# EAGLE design PowerSupply_5V_v2 (EAGLE 9.6.2)

## Sheet 1 of 3: MAIN
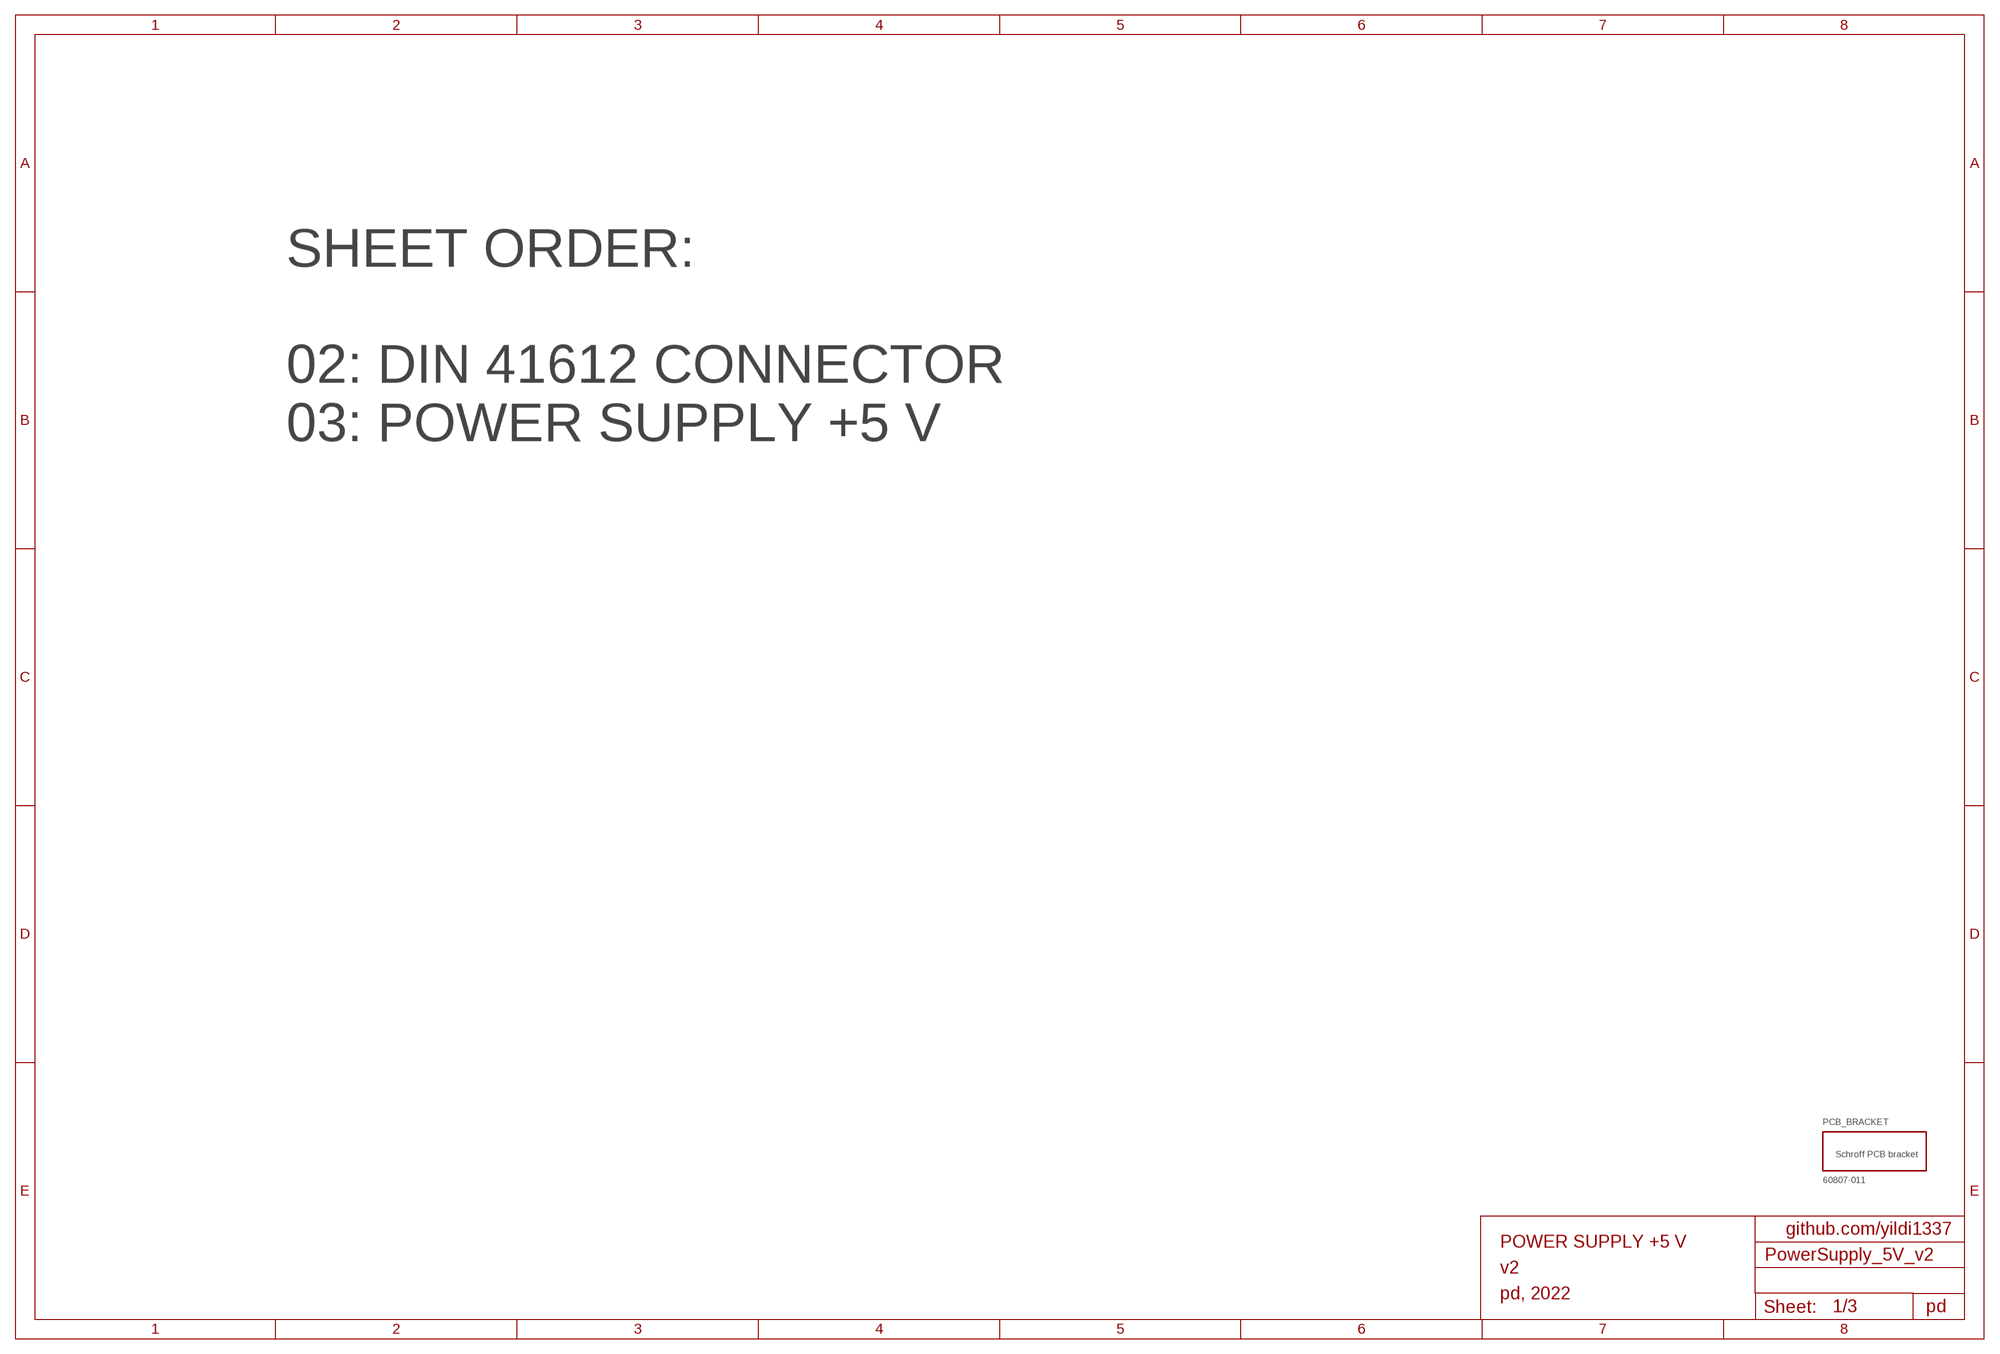
[diagram p0: schematic, sheet 1]

### Parts
PCB_BRACKET  60807-011  [60807-011]

### Notes on the sheet
- SHEET ORDER:
  
  02: DIN 41612 CONNECTOR
  03: POWER SUPPLY +5 V
- github.com/yildi1337
- POWER SUPPLY +5 V
- v2
- pd, 2022
- pd

## Sheet 2 of 3: DIN 41612 CONNECTOR
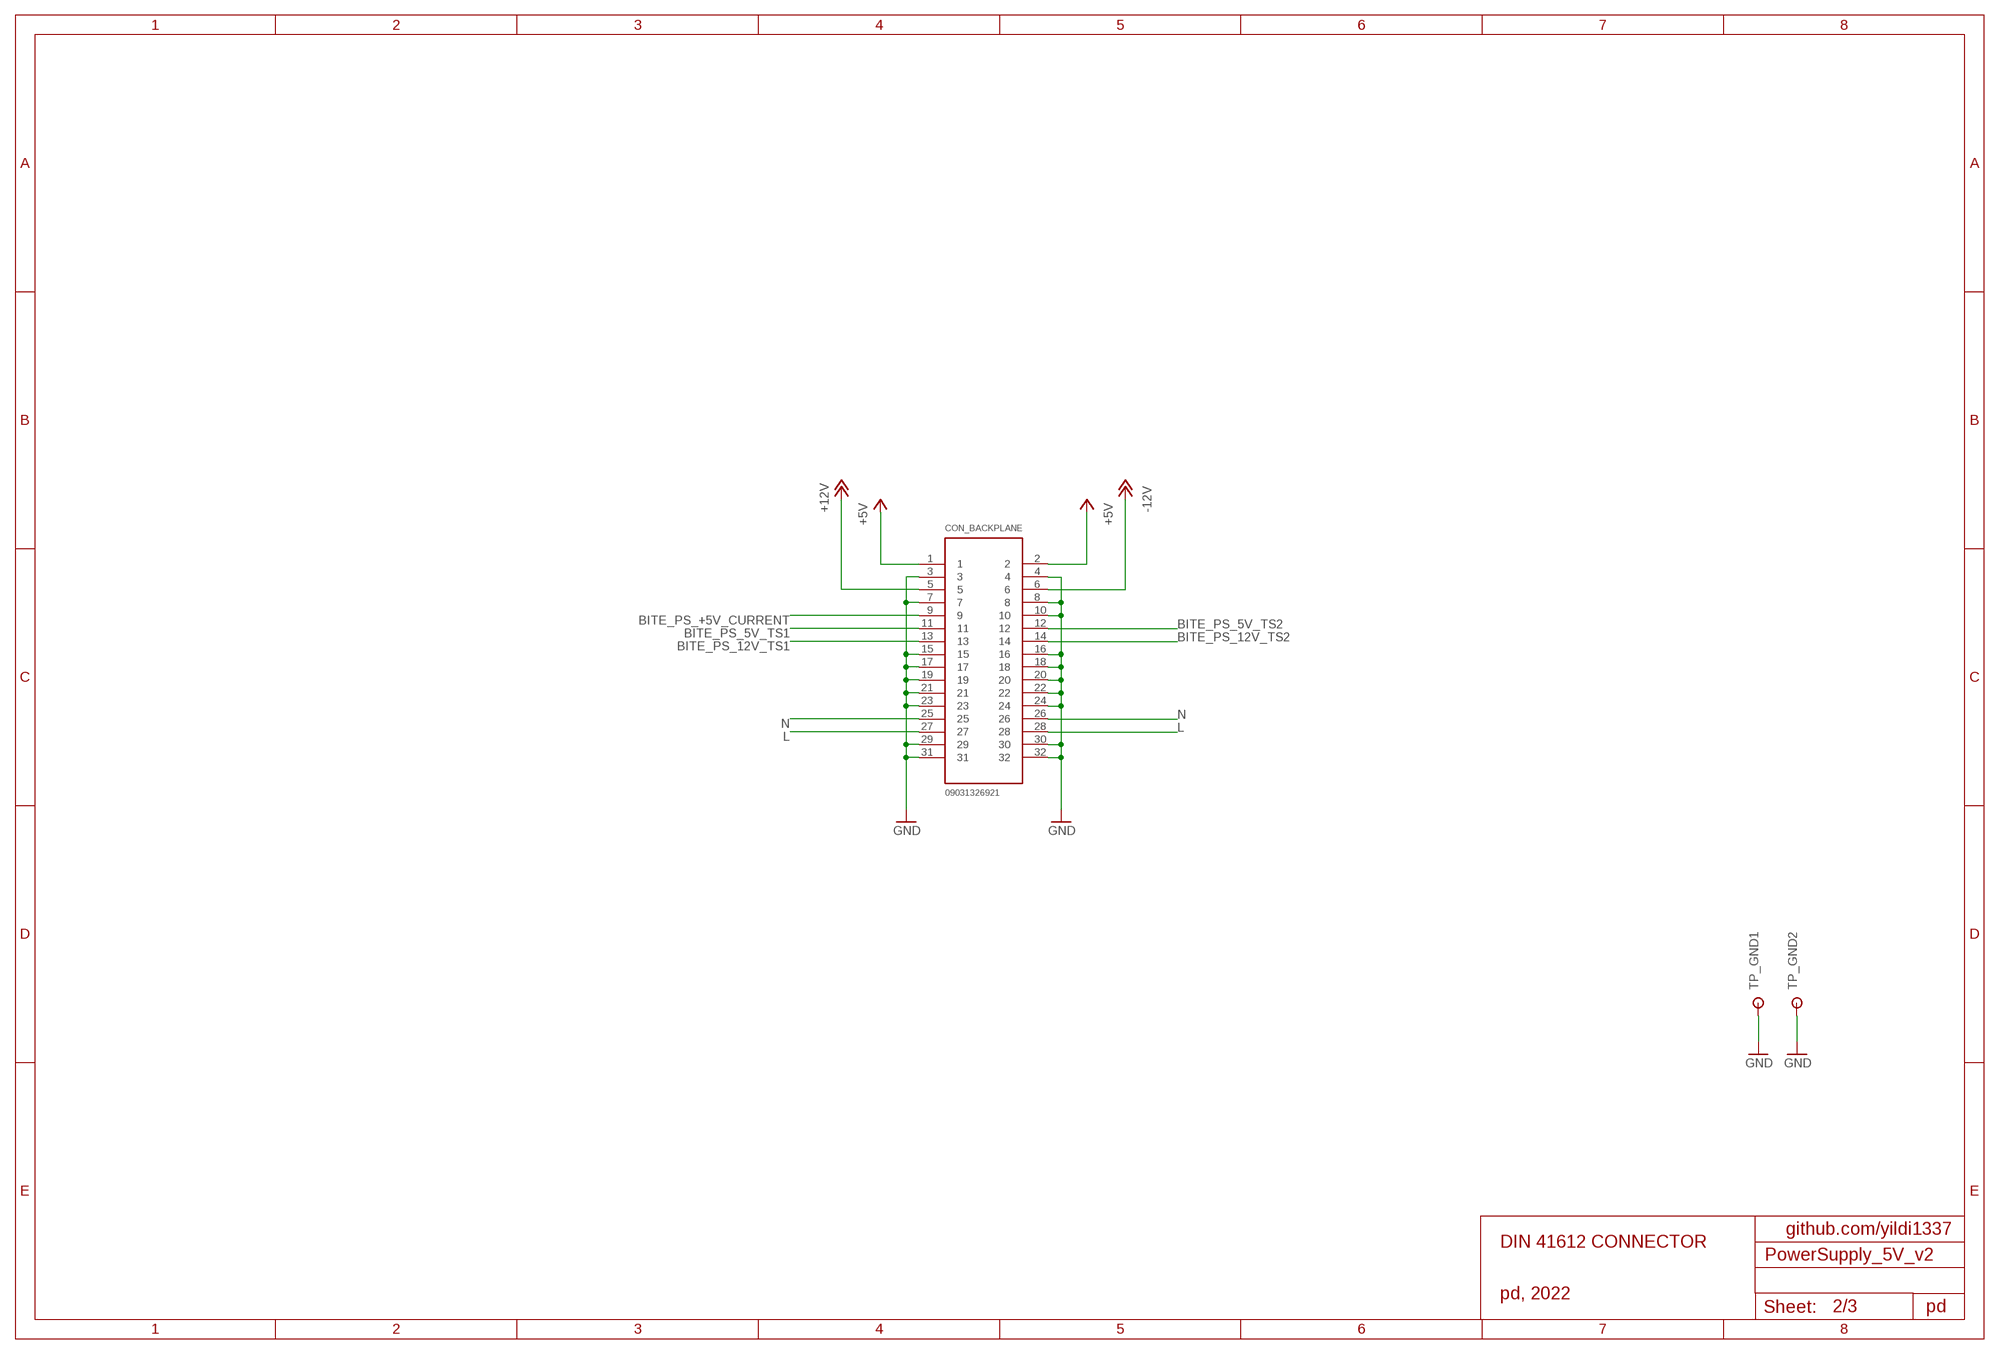
[diagram p1: schematic, sheet 2]

### Parts
CON_BACKPLANE  09031326921  [09031326921]
TP_GND1  RSPRO-1MM-TERMINAL-POST-2622034  [RSPRO-1MM-TERMINAL-POST-2622034]
TP_GND2  RSPRO-1MM-TERMINAL-POST-2622034  [RSPRO-1MM-TERMINAL-POST-2622034]

### Nets
+5V: CON_BACKPLANE.1 CON_BACKPLANE.2 ; also sheet 3
+12V: CON_BACKPLANE.5
-12V: CON_BACKPLANE.6
BITE_PS_5V_TS1: CON_BACKPLANE.11
BITE_PS_5V_TS2: CON_BACKPLANE.12
BITE_PS_12V_TS1: CON_BACKPLANE.13
BITE_PS_12V_TS2: CON_BACKPLANE.14
BITE_PS_+5V_CURRENT: CON_BACKPLANE.9
GND: CON_BACKPLANE.3 CON_BACKPLANE.4 CON_BACKPLANE.7 CON_BACKPLANE.8 CON_BACKPLANE.10 CON_BACKPLANE.15 CON_BACKPLANE.16 CON_BACKPLANE.17 CON_BACKPLANE.18 CON_BACKPLANE.19 CON_BACKPLANE.20 CON_BACKPLANE.21 CON_BACKPLANE.22 CON_BACKPLANE.23 CON_BACKPLANE.24 CON_BACKPLANE.29 CON_BACKPLANE.30 CON_BACKPLANE.31 CON_BACKPLANE.32 TP_GND1.P$1 TP_GND2.P$1 ; also sheet 3
L: CON_BACKPLANE.27 CON_BACKPLANE.28 ; also sheet 3
N: CON_BACKPLANE.25 CON_BACKPLANE.26 ; also sheet 3

### Notes on the sheet
- github.com/yildi1337
- DIN 41612 CONNECTOR
- pd, 2022
- pd

## Sheet 3 of 3: POWER SUPPLY +5 V
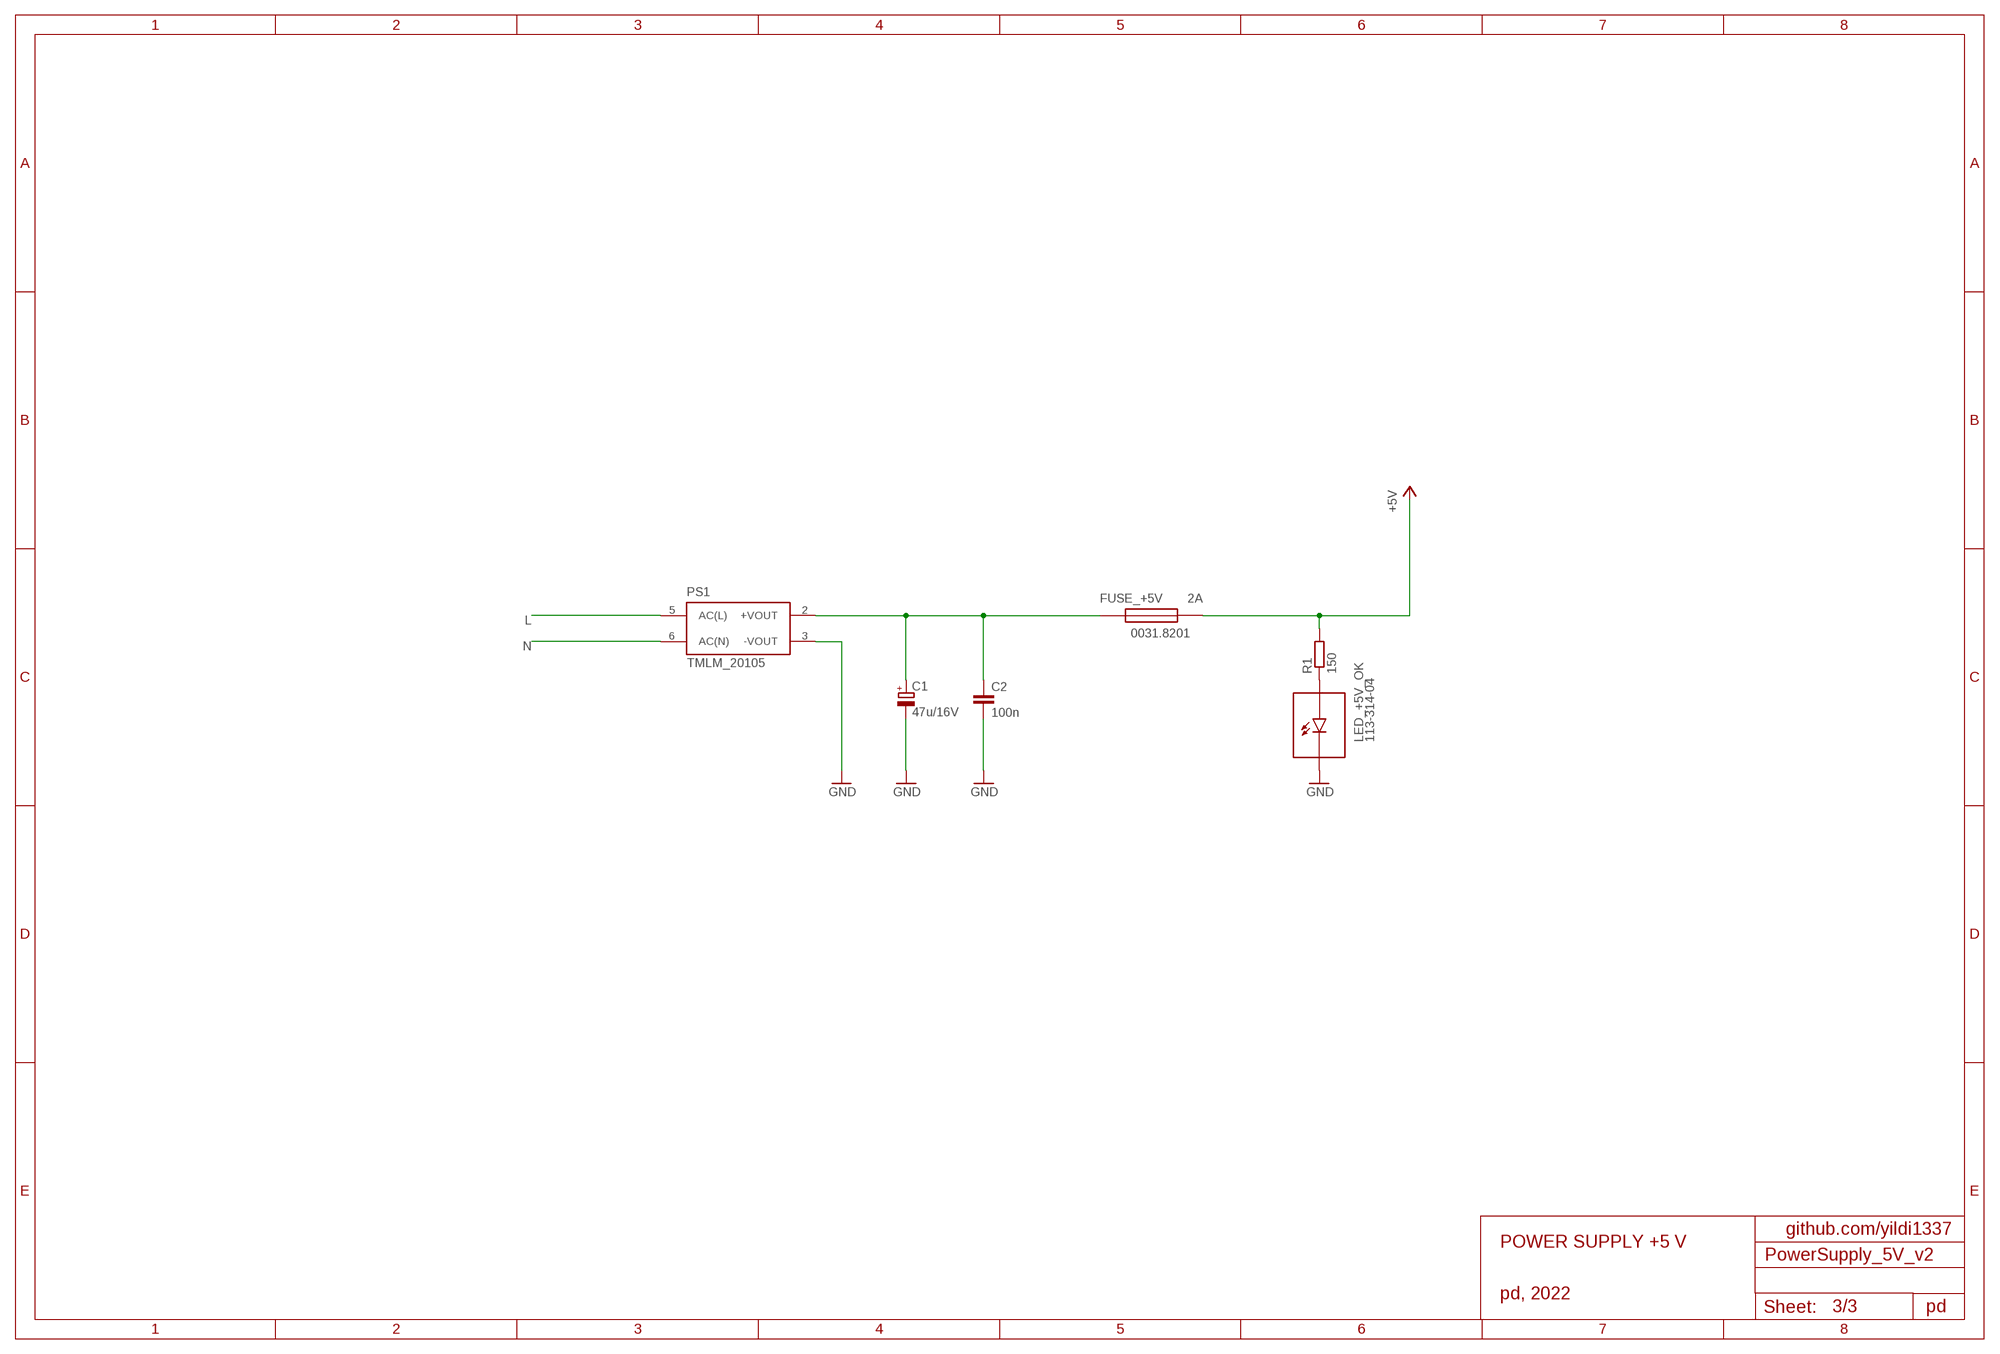
[diagram p2: schematic, sheet 3]

### Parts
C1  47u/16V  CPOL-EU153CLV-0505  [153CLV-0505]
C2  100n  C-EUC0603  [C0603]
FUSE_+5V  0031.8201  [0031.8201]
LED_+5V_OK  113-314-04  [113-314-04]
PS1  TMLM_20105  TMLM_201XX  [TMLM_201XX]
R1  150  R-EU_R0603  [R0603]

### Nets
+5V: FUSE_+5V.2 R1.2 ; also sheet 2
GND: C1.- C2.2 LED_+5V_OK.-(C) PS1.3(-VOUT) ; also sheet 2
L: PS1.5(AC(L)) ; also sheet 2
N: PS1.6(AC(N)) ; also sheet 2
N$1: C1.+ C2.1 FUSE_+5V.1 PS1.2(+VOUT)
N$7: LED_+5V_OK.+(A) R1.1

### Notes on the sheet
- 2A
- github.com/yildi1337
- POWER SUPPLY +5 V
- pd, 2022
- pd

## Library data of the parts
C1 = rcl:CPOL-EU: POLARIZED CAPACITOR, European symbol; SPICEPREFIX: C
C2 = rcl:C-EU: CAPACITOR, European symbol; SPICEPREFIX: C
CON_BACKPLANE = 09031326921:09031326921
FUSE_+5V = 0031.8201:0031.8201
LED_+5V_OK = 113-314-04:113-314-04
PCB_BRACKET = 60807-011:60807-011
PS1 = TMLM_201XX:TMLM_201XX
R1 = rcl:R-EU_: RESISTOR, European symbol; SPICEPREFIX: R
TP_GND1 TP_GND2 = RSPRO-1MM-TERMINAL-POST-2622034:RSPRO-1MM-TERMINAL-POST-2622034

## Board
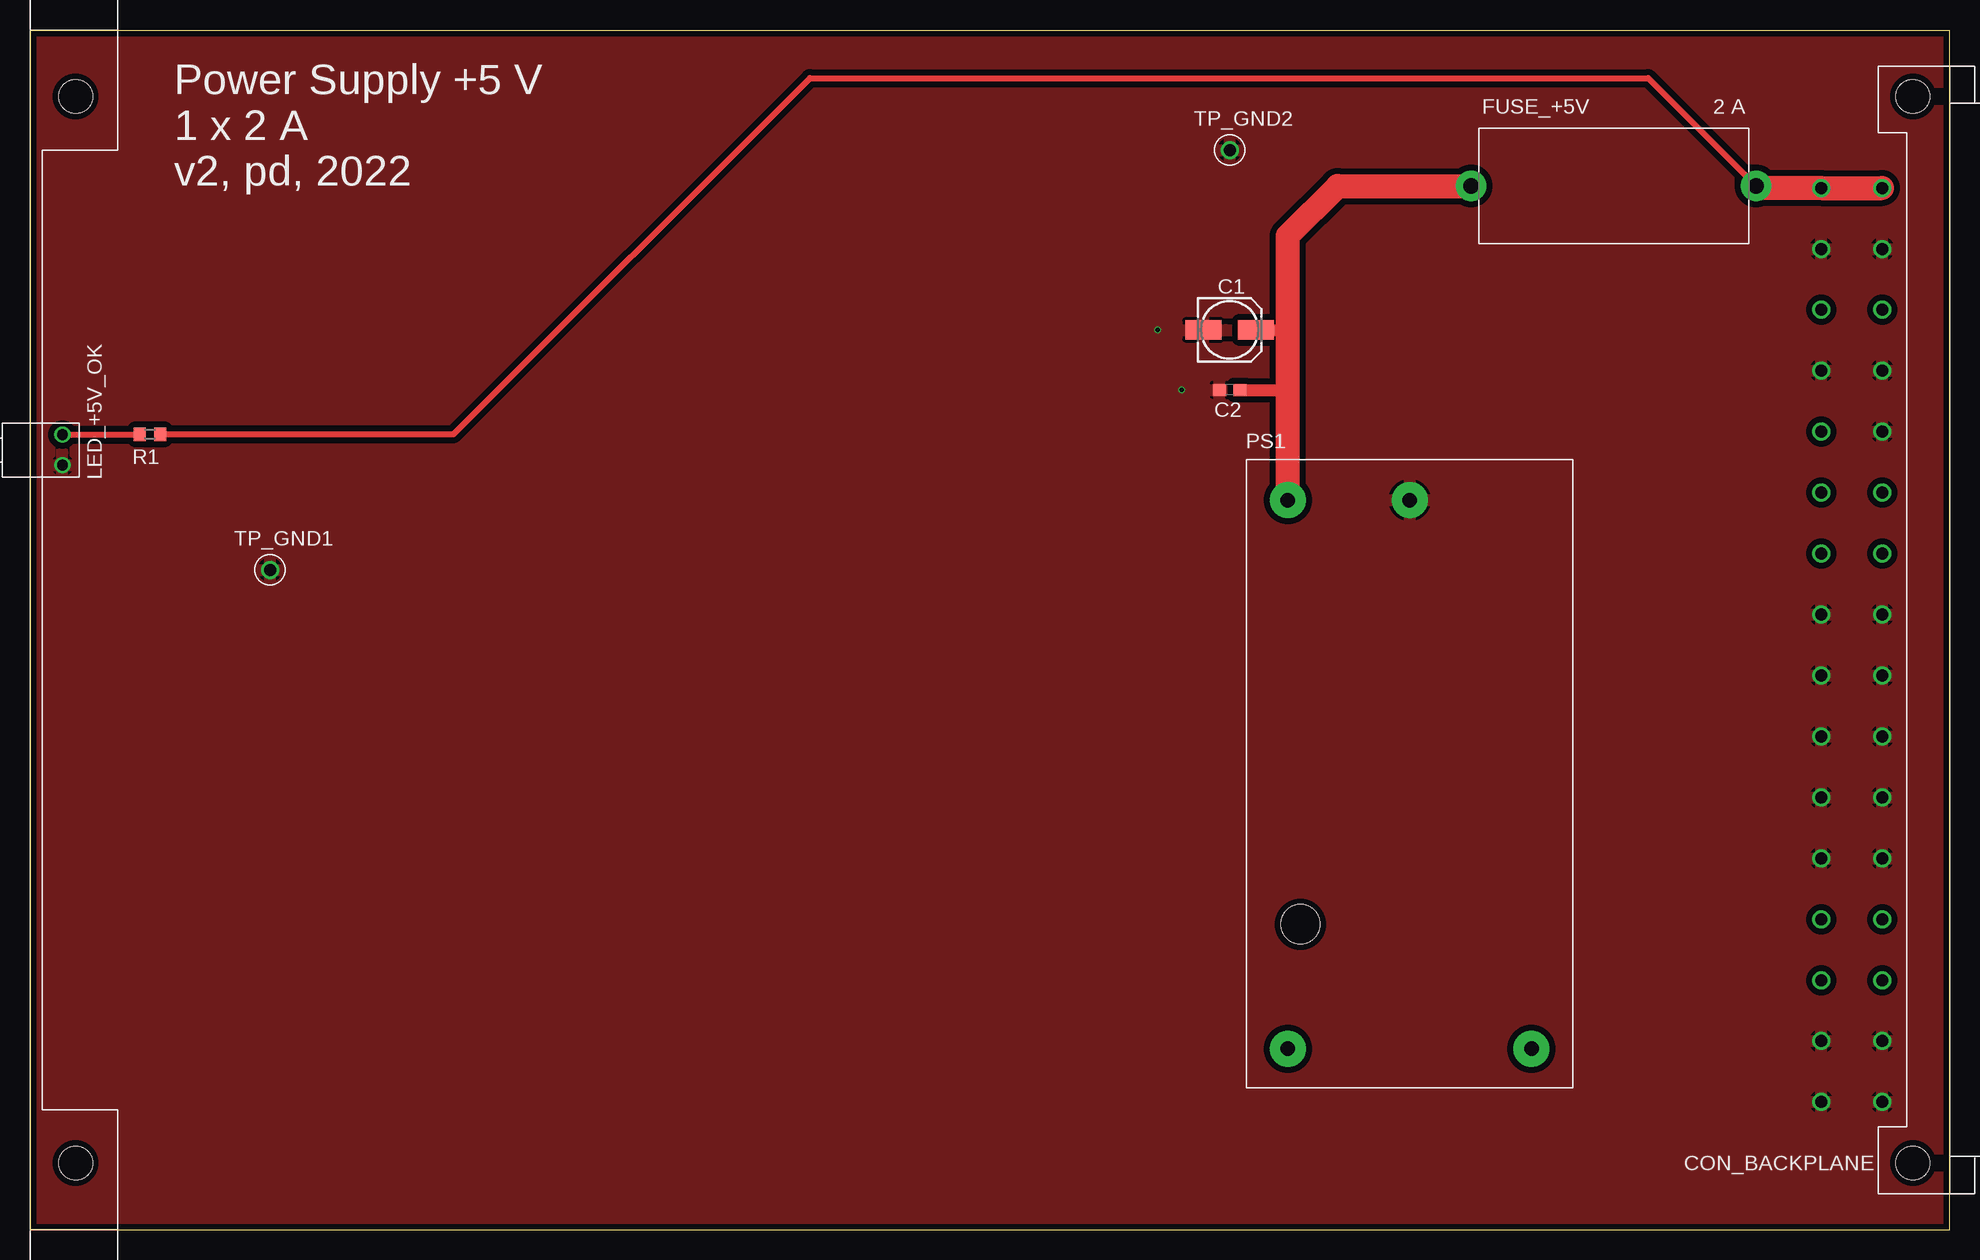
[diagram p3: board, top side]
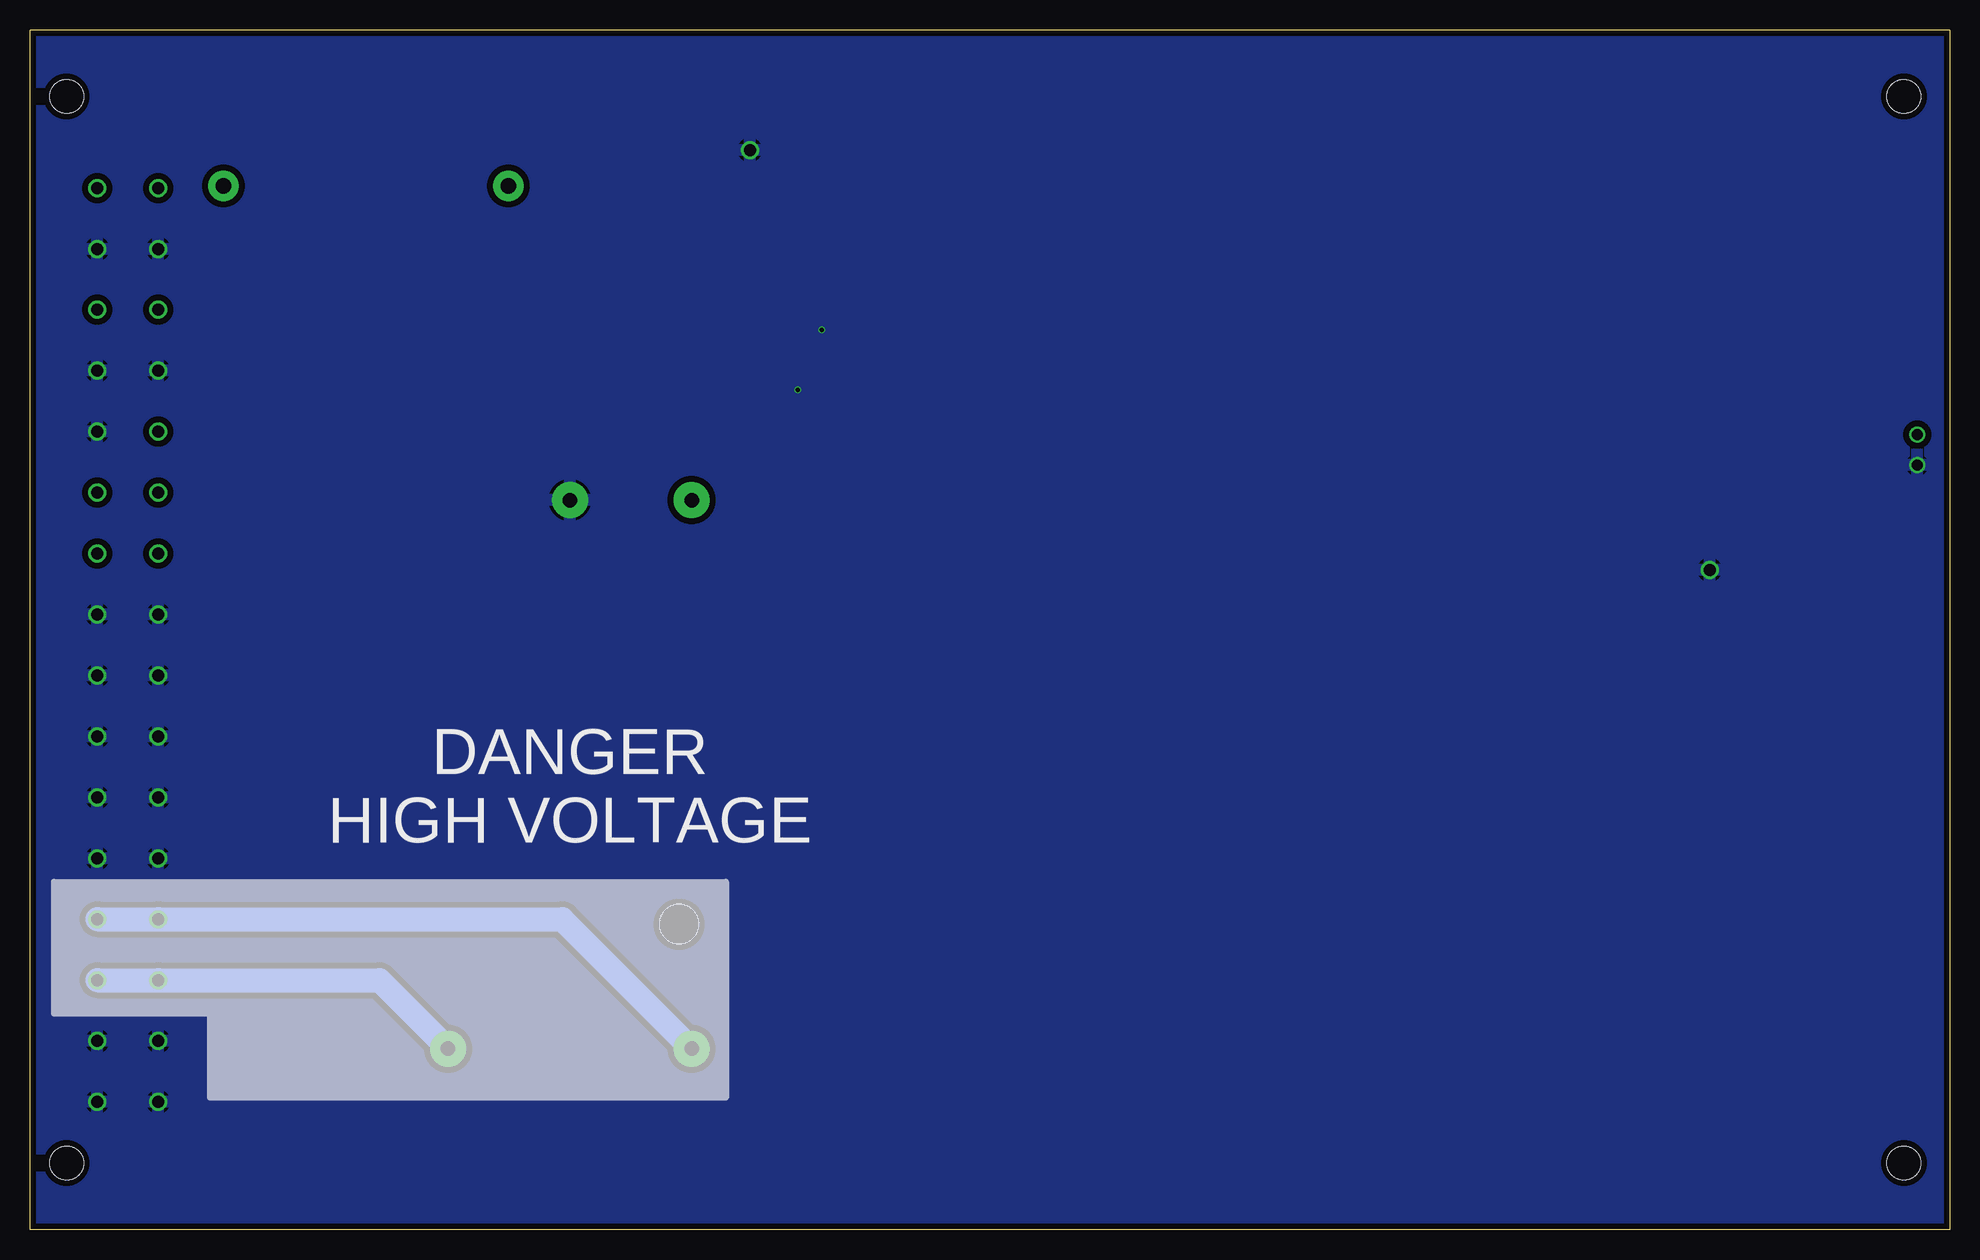
[diagram p4: board, bottom side, seen from below]

Size 160 x 100 mm. Coordinates in mm from the lower left corner, seen from the top.
Outline: 0,0 160,0 160,100 0,100 0,0
Copper layers (1*16): Top 0.035559375mm / dielectric 1.6mm / Bottom 0.035559375mm
Design rules "jlcpcb2layer": minimum track width 5mil, minimum drill 12mil, track to track 5mil, track to pad 5mil, pad to pad 5mil, via to via 5mil, smd to smd 5mil, copper to edge 8mil, drill to drill 6mil, minimum pad ring 5mil, minimum via ring 3mil, stop-mask expansion 2.5mil, vias tented up to drill 0mil, thermal gap 10mil

### Footprints (pad centres in the part's own frame; a part is rotated, then mirrored left to right if it is on the bottom)
153CLV-0505 = smd 3 x 1.6: + 2.2,0; - -2.2,0
C0603 = smd 1.1 x 1: 1 -0.85,0; 2 0.85,0
09031326921 = drill 1: 1 36.83,10.7; 2 36.83,5.62; 3 31.75,10.7; 4 31.75,5.62; 5 26.67,10.7; 6 26.67,5.62; 7 21.59,10.7; 8 21.59,5.62; 9 16.51,10.7; 10 16.51,5.62; 11 11.43,10.7; 12 11.43,5.62; 13 6.35,10.7; 14 6.35,5.62; 15 1.27,10.7; 16 1.27,5.62; 17 -3.81,10.7; 18 -3.81,5.62; 19 -8.89,10.7; 20 -8.89,5.62; 21 -13.97,10.7; 22 -13.97,5.62; 23 -19.05,10.7; 24 -19.05,5.62; 25 -24.13,10.7; 26 -24.13,5.62; 27 -29.21,10.7; 28 -29.21,5.62; 29 -34.29,10.7; 30 -34.29,5.62; 31 -39.37,10.7; 32 -39.37,5.62 | hole 2.8: -44.45,3.05; 44.45,3.05
0031.8201 = drill 1.3 pad 2.54: 1 -11.875,0; 2 11.875,0
113-314-04 = drill 0.9: + -1.27,0; - 1.27,0
60807-011 = hole 2.8: 0,44.45; 0,-44.45
TMLM_201XX = drill 1.2 pad 3: 2 -10.16,22.8; 3 0,22.8; 5 10.16,-22.92; 6 -10.16,-22.92 | hole 3.25: -9.1,-12.55
R0603 = smd 1 x 1.1: 1 -0.85,0; 2 0.85,0
RSPRO-1MM-TERMINAL-POST-2622034 = drill 1: P$1 0,0

### Placement (x,y rotation side)
C1  100,75 0 top
C2  100,70 180 top
CON_BACKPLANE  160,50 90 top
FUSE_+5V  132,87 0 top
LED_+5V_OK  2.7,65 270 top
PCB_BRACKET  3.8,50 0 top
PS1  115,38 0 top
R1  10,66.3 0 top
TP_GND1  20,55 0 top
TP_GND2  100,90 0 top

### Tracks (layer width: path | path; a pad name or v marks a point on that pad's centre or on a via)
+5V
  Top 0.5: R1.2 35.3,66.3 65,96 134.88,96 144.04,86.83
  Top 2: CON_BACKPLANE.2 CON_BACKPLANE.1 144.04,86.83 FUSE_+5V.2
GND  (via drill 0.35)
  other vias: 94,75 96,70
  pour Top (isolate 0.5): 0,0 0,100 160,100 160,0
  pour Bottom (isolate 0.5): 0,0 0,100 160,100 160,0
L
  Bottom 2: CON_BACKPLANE.28 CON_BACKPLANE.27 130.87,20.79 PS1.5
N
  Bottom 2: CON_BACKPLANE.26 CON_BACKPLANE.25 115.63,25.87 PS1.6
N$1
  Top 1: C2.1 104.84,70 | C1.+ 104.84,75
  Top 2: FUSE_+5V.1 109,87 104.84,82.84 104.84,75 104.84,70 PS1.2
N$7
  Top 0.5: LED_+5V_OK.+ 9.12,66.27 R1.1

### Text on the board
tPlace: 2 A | Power Supply +5 V / 1 x 2 A / v2, pd, 2022
bPlace: DANGER / HIGH VOLTAGE